# EAGLE design timetracker-1-3 (EAGLE 7.5.0)
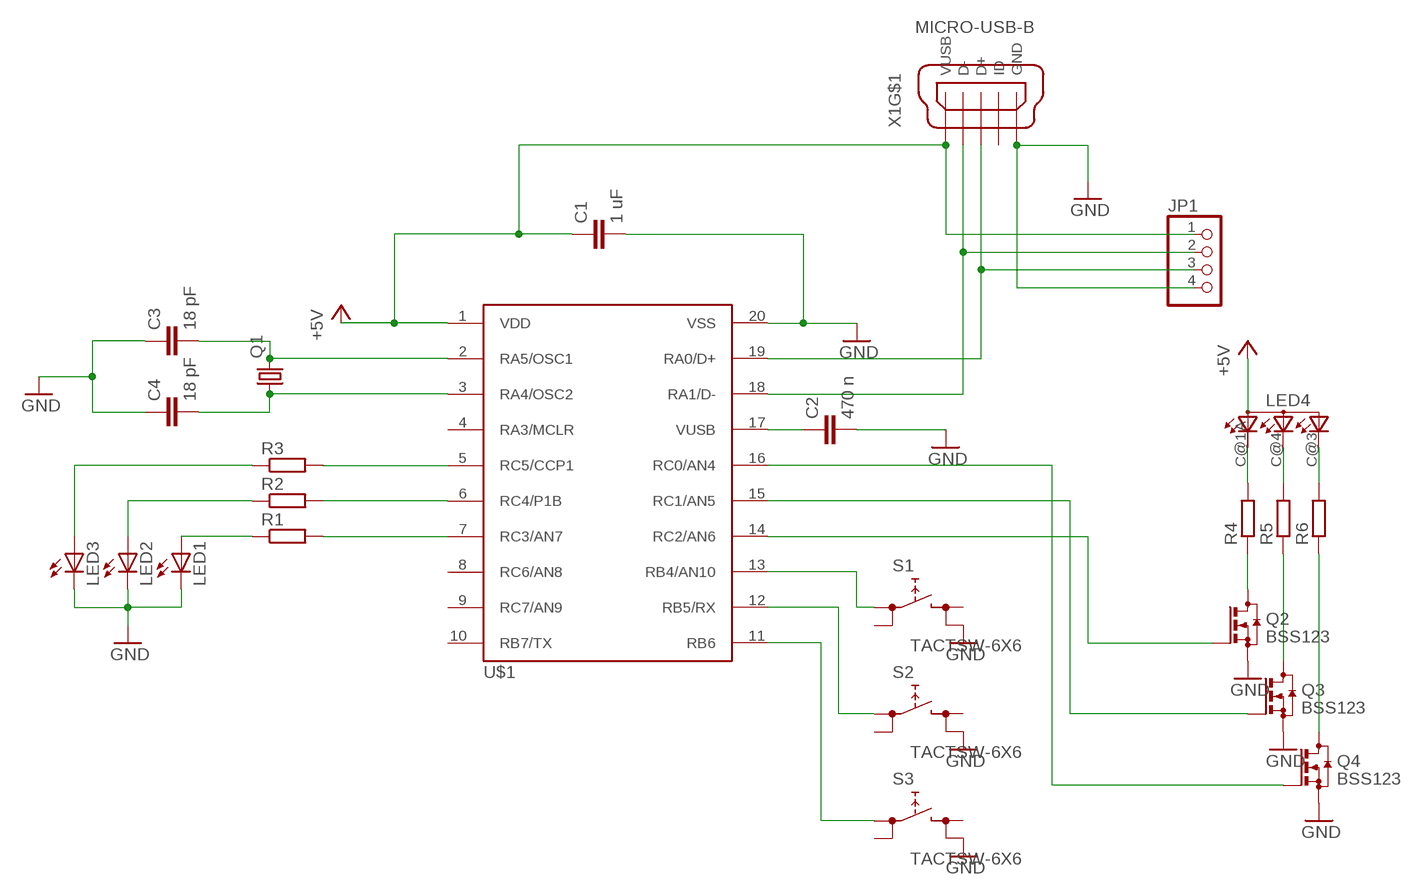
[diagram p0: schematic, sheet 1]

## Parts
C1  1 uF  C-EUC0805  [C0805]
C2  470 n  C-EUC0805  [C0805]
C3  18 pF  C-EUC0805  [C0805]
C4  18 pF  C-EUC0805  [C0805]
JP1  PINHD-1X4  [1X04]
LED1  LEDSML0805  [SML0805]
LED2  LEDSML0805  [SML0805]
LED3  LEDSML0805  [SML0805]
LED4  RGBLED-3P-LCC-4  [P-LCC-4]
Q1  CRYSTALHC49UP  [HC49UP]
Q2  BSS123  [SOT23]
Q3  BSS123  [SOT23]
Q4  BSS123  [SOT23]
R1  R-EU_R0805  [R0805]
R2  R-EU_R0805  [R0805]
R3  R-EU_R0805  [R0805]
R4  R-EU_R0805  [R0805]
R5  R-EU_R0805  [R0805]
R6  R-EU_R0805  [R0805]
S1  TACTSW-6X6  [TACTSW-6X6]
S2  TACTSW-6X6  [TACTSW-6X6]
S3  TACTSW-6X6  [TACTSW-6X6]
U$1  PIC18F14K50SMD  [DIL20-SMD]
X1  MICRO-USB-B  [MICRO-B-PAC]

## Nets
+5V: C1.1 JP1.1 LED4.A(A2) U$1.1(VDD) X1.1(VUSB)
GND: C1.2 C2.2 C3.1 C4.1 JP1.4 LED1.C LED2.C LED3.C Q2.2(S) Q3.2(S) Q4.2(S) S1.4(2.2) S2.4(2.2) S3.4(2.2) U$1.20(VSS) X1.5(GND)
N$1: C2.1 U$1.17(VUSB)
N$2: C3.2 Q1.2 U$1.2(RA5/OSC1)
N$3: C4.2 Q1.1 U$1.3(RA4/OSC2)
N$4: JP1.3 U$1.19(RA0/D+) X1.3(D+)
N$5: JP1.2 U$1.18(RA1/D-) X1.2(D-)
N$8: LED1.A R1.1
N$9: R1.2 U$1.7(RC3/AN7)
N$10: R2.2 U$1.6(RC4/P1B)
N$11: LED2.A R2.1
N$12: R3.2 U$1.5(RC5/CCP1)
N$13: LED3.A R3.1
N$14: Q2.3(D) R4.1
N$15: LED4.C@1(CRED) R4.2
N$16: Q2.1(G) U$1.14(RC2/AN6)
N$17: Q3.1(G) U$1.15(RC1/AN5)
N$18: Q4.1(G) U$1.16(RC0/AN4)
N$19: LED4.C@4(CGREEN) R5.2
N$20: LED4.C@3(CBLUE) R6.2
N$21: Q3.3(D) R5.1
N$22: Q4.3(D) R6.1
N$23: S1.1(1.1) U$1.13(RB4/AN10)
N$24: S2.1(1.1) U$1.12(RB5/RX)
N$25: S3.1(1.1) U$1.11(RB6)
Unconnected: S1.2(1.2) S1.3(2.1) S2.2(1.2) S2.3(2.1) S3.2(1.2) S3.3(2.1) U$1.4(RA3/MCLR) U$1.8(RC6/AN8) U$1.9(RC7/AN9) U$1.10(RB7/TX) X1.4(ID) X1.M1(S:S1) X1.M2(S:S2) X1.M3(S:S3) X1.M4(S:S4)

## Library data of the parts
C1-C4 = rcl:C-EU: CAPACITOR, European symbol
JP1 = pinhead:PINHD-1X4: PIN HEADER
LED1-LED3 = led:LED: LED OSRAM: - CHIPLED LG R971, LG N971, LY N971, LG Q971, LY Q971, LO R971, LY R971 LH N974, LH R974 LS Q976, LO Q976, LY Q976 LO Q996 - Hyper CHIPLED LW Q18S LB Q993, LB Q99A, LB R99A - SideLED LS A670, LO A670, LY A670, LG A670, LP A670 LB A673, LV A673, LT A673, LW A673 LH A674 LY A675 LS A676, LA A676, LO A676, LY A676, LW A676 LS A679, LY A679, LG A679 - Hyper Micro SIDELED® LS Y876, LA Y876, LO Y876, LY Y876 LT Y87S - SmartLED LW L88C, LW L88S LB L89C, LB L89S, LG L890 LS L89K, LO L89K, LY L89K LS L896, LA L896, LO L896, LY L896 - TOPLED LS T670, LO T670, LY T670, LG T670, LP T670 LSG T670, LSP T670, LSY T670, LOP T670, LYG T670 LG T671, LOG T671, LSG T671 LB T673, LV T673, LT T673, LW T673 LH T674 LS T676, LA T676, LO T676, LY T676, LB T676, LH T676, LSB T676, LW T676 LB T67C, LV T67C, LT T67C, LS T67K, LO T67K, LY T67K, LW E67C LS E67B, LA E67B, LO E67B, LY E67B, LB E67C, LV E67C, LT E67C LW T67C LS T679, LY T679, LG T679 LS T770, LO T770, LY T770, LG T770, LP T770 LB T773, LV T773, LT T773, LW T773 LH T774 LS E675, LA E675, LY E675, LS T675 LS T776, LA T776, LO T776, LY T776, LB T776 LHGB T686 LT T68C, LB T68C - Hyper Mini TOPLED® LB M676 - Mini TOPLED Santana® LG M470 LS M47K, LO M47K, LY M47K Source: http://www.osram.convergy.de LUXEON: - LUMILED® LXK2-PW12-R00, LXK2-PW12-S00, LXK2-PW14-U00, LXK2-PW14-V00 LXK2-PM12-R00, LXK2-PM12-S00, LXK2-PM14-U00 LXK2-PE12-Q00, LXK2-PE12-R00, LXK2-PE12-S00, LXK2-PE14-T00, LXK2-PE14-U00 LXK2-PB12-K00, LXK2-PB12-L00, LXK2-PB12-M00, LXK2-PB14-N00, LXK2-PB14-P00, LXK2-PB14-Q00 LXK2-PR12-L00, LXK2-PR12-M00, LXK2-PR14-Q00, LXK2-PR14-R00 LXK2-PD12-Q00, LXK2-PD12-R00, LXK2-PD12-S00 LXK2-PH12-R00, LXK2-PH12-S00 LXK2-PL12-P00, LXK2-PL12-Q00, LXK2-PL12-R00 Source: www.luxeon.com KINGBRIGHT: KA-3528ASYC Source: www.kingbright.com
LED4 = g-e2e-training:RGBLED-3: OSRAM - Hyper Multi TOPLED® (RGB) LB E673, LV E673, LT E673 - Power TOPLED® Enhanced optical Power LED (HOP2000) LS E67B, LA E67B, LO E67B, LY E67B - Hyper Multi TOPLED® Enhanced optical Power LED (HOP2000 / ATON®) LATB T66B - Hyper Multi TOPLED® Hyper-Bright LED LATB T686 Source: http://www.osram.convergy.de/
Q1 = crystal:CRYSTAL: CRYSTAL; OC_FARNELL: unknown; OC_NEWARK: unknown
Q2-Q4 = transistor-small-signal:BSS123: N-CHANNEL MOS FET
R1-R6 = rcl:R-EU_: RESISTOR, European symbol
S1-S3 = g-e2e-training:TACTSW-6X6: 6.2 X 6.5mm TACT Switch (SMD) Source: http://www3.alps.co.jp/WebObjects/catalog.woa/PDF/E/Switch/Tact/SKHM/SKHM.PDF
U$1 = timetracker:PIC18F14K50
X1 = g-e2e-training:MICRO-USB-B: MINI USB-B Conector Source: www.cypressindustries.com

## Board
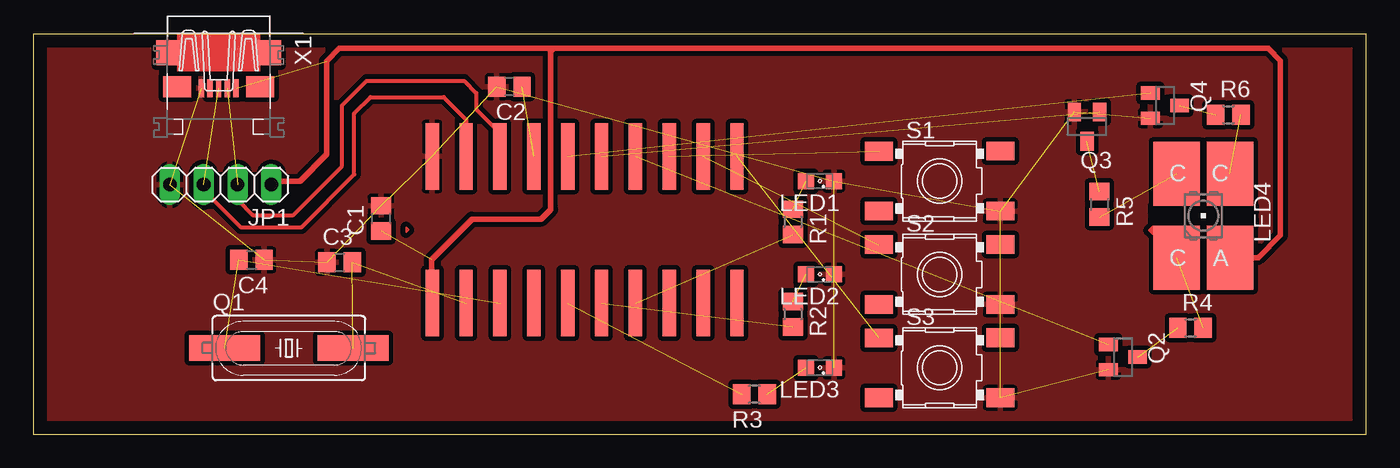
[diagram p1: board, top side]

Size 100 x 30 mm. Coordinates in mm from the lower left corner, seen from the top.
Outline: 0,0 100,0 100,30 0,30 0,0
Copper layers (1*16): Top 0.035mm / dielectric 1.5mm / Bottom 0.035mm
Design rules "default": minimum track width 10mil, minimum drill 24mil, track to track 8mil, track to pad 8mil, pad to pad 8mil, via to via 8mil, smd to smd 8mil, copper to edge 40mil, drill to drill 8mil, minimum pad ring 10mil, minimum via ring 8mil, stop-mask expansion 4mil, vias tented up to drill 0mil, thermal gap 10mil

### Footprints (pad centres in the part's own frame; a part is rotated, then mirrored left to right if it is on the bottom)
C0805 = smd 1.3 x 1.5: 1 -0.95,0; 2 0.95,0
1X04 = drill 1.016 long: 1 -3.81,0; 2 -1.27,0; 3 1.27,0; 4 3.81,0
SML0805 = smd 1.2 x 1.2: A 1.05,0; C -1.05,0
P-LCC-4 = smd 3.5 x 4.8: A -2,3.15; C@1 2,3.15; C@3 -2,-3.15; C@4 2,-3.15
HC49UP = smd 5.334 x 1.93: 1 -4.826,0; 2 4.826,0
SOT23 = smd 1 x 1.4: 1 -0.95,-1.1; 2 0.95,-1.1; 3 0,1.1
R0805 = smd 1.3 x 1.5: 1 -0.95,0; 2 0.95,0
TACTSW-6X6 = smd 2.1 x 1.4: 1 -4.55,2.24; 2 4.55,2.25; 3 -4.55,-2.25; 4 4.55,-2.25
DIL20-SMD = smd 1 x 5: 1 -11.43,-5.5; 2 -8.89,-5.5; 3 -6.35,-5.5; 4 -3.81,-5.5; 5 -1.27,-5.5; 6 1.27,-5.5; 7 3.81,-5.5; 8 6.35,-5.5; 9 8.89,-5.5; 10 11.43,-5.5; 11 11.43,5.5; 12 8.89,5.5; 13 6.35,5.5; 14 3.81,5.5; 15 1.27,5.5; 16 -1.27,5.5; 17 -3.81,5.5; 18 -6.35,5.5; 19 -8.89,5.5; 20 -11.43,5.5
MICRO-B-PAC = smd 1.35 x 0.4: 1 2.675,1.3; 2 2.675,0.65; 3 2.675,0; 4 2.675,-0.65; 5 2.675,-1.3 | smd 1.9 x 1.8: M1 0,-3.8; M2 0,3.8 | smd 1.6 x 2.1: M3 2.55,3.1; M4 2.55,-3.1

### Placement (x,y rotation side)
C1  26.09,16.2 90 top
C2  35.72,26.09 180 top
C3  22.98,12.91 0 top
C4  16.37,13.09 180 top
JP1  14.05,18.74 180 top
LED1  59,19 180 top
LED2  59,12 180 top
LED3  59,5 180 top
LED4  87.78,16.41 180 top
Q1  19.17,6.48 0 top
Q2  81.75,5.8 270 top
Q3  79.05,23.09 180 top
Q4  84.91,24.67 270 top
R1  56.99,15.94 270 top
R2  56.99,9.02 270 top
R3  54.1,3.01 180 top
R4  86.82,7.99 0 top
R5  79.99,17.26 270 top
R6  89.66,23.99 0 top
S1  68,19 0 top
S2  68,12 0 top
S3  68,5 0 top
U$1  41.36,15.35 0 top
X1  13.9,28.64 270 top

### Tracks (layer width: path | path; a pad name or v marks a point on that pad's centre or on a via)
+5V  (2 unrouted)
  Top 0.406: JP1.1 18.12,19 20,19 22,21 22,28 22.96,28.96 39.01,28.96 | 39.01,28.96 92.66,28.96 93.57,28.04 93.57,14.94 91.9,13.26 LED4.A | U$1.1 29.87,9.91 29.87,13.11 32.92,16.15 38.1,16.15 38.81,16.87 38.81,28.75 39.01,28.96
GND  (15 unrouted)
  pour Top (isolate 0.356): 0,30 0,0 100,0 100,30
N$1  (1 unrouted)
N$2  (2 unrouted)
N$3  (2 unrouted)
N$4  (1 unrouted)
  Top 0.305: JP1.3 12.78,18.31 15.54,15.54 20.12,15.54 24.08,19.51 24.08,24.08 25.3,25.3 30.79,25.3 32.47,23.61 U$1.19
N$5  (1 unrouted)
  Top 0.305: JP1.2 15.32,17.6 16.46,16.46 19.51,16.46 23.16,20.12 23.16,24.69 24.99,26.52 32.31,26.52 33.22,25.6 33.22,24.38 35.01,22.6 U$1.18
N$8  (1 unrouted)
N$9  (1 unrouted)
N$10  (1 unrouted)
N$11  (1 unrouted)
N$12  (1 unrouted)
N$13  (1 unrouted)
N$14  (1 unrouted)
N$15  (1 unrouted)
N$16  (1 unrouted)
N$17  (1 unrouted)
N$18  (1 unrouted)
N$19  (1 unrouted)
N$20  (1 unrouted)
N$21  (1 unrouted)
N$22  (1 unrouted)
N$23  (1 unrouted)
N$24  (1 unrouted)
N$25  (1 unrouted)